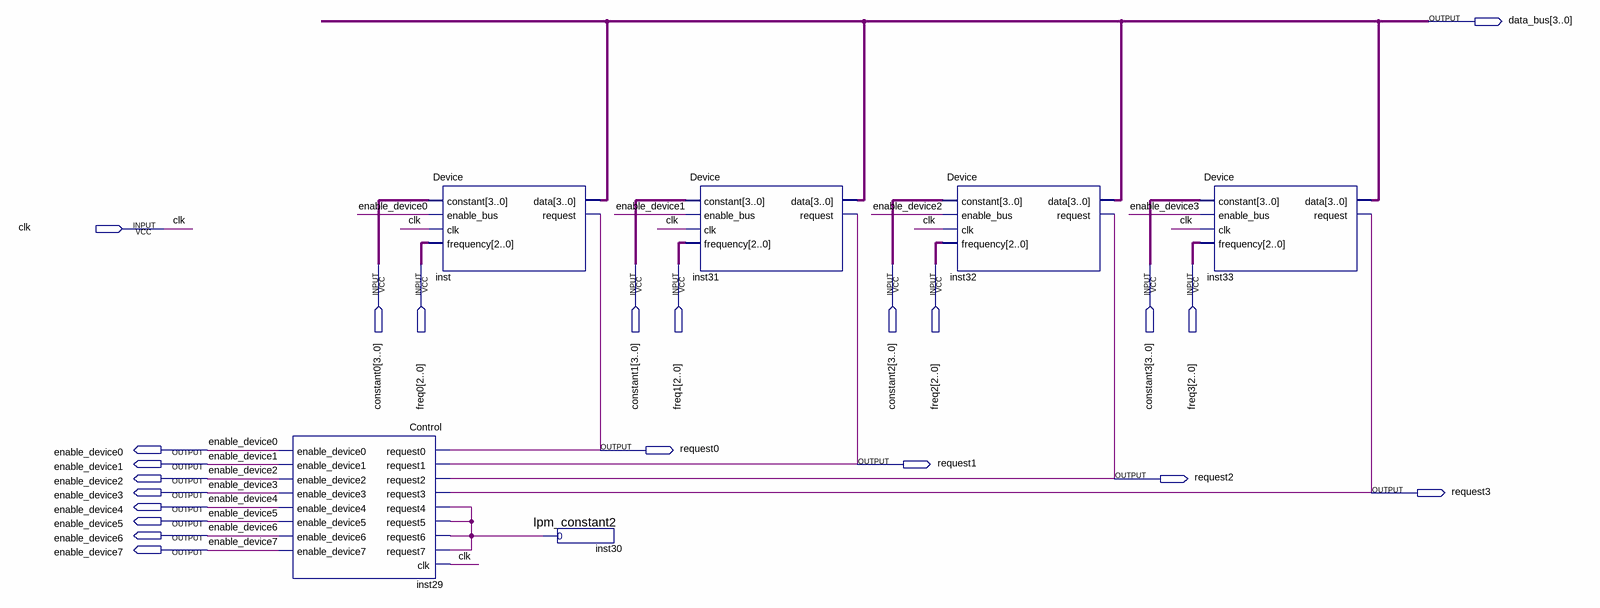
[diagram p0: schematic sheet]
// Quartus schematic LAB_5.bdf as structural Verilog: 6 symbols, 22 pins
module LAB_5 (
  input  clk,
  input  [3:0] constant0,
  input  [2:0] freq0,
  input  [3:0] constant1,
  input  [2:0] freq1,
  input  [3:0] constant2,
  input  [2:0] freq2,
  input  [3:0] constant3,
  input  [2:0] freq3,
  output [3:0] data_bus,
  output enable_device0,
  output request0,
  output enable_device1,
  output request1,
  output enable_device2,
  output request2,
  output enable_device3,
  output request3,
  output enable_device4,
  output enable_device5,
  output enable_device6,
  output enable_device7
);

  wire inst30_result;

  Control inst29 (
    .request0(request0), .request1(request1), .request2(request2), .request3(request3),
    .request4(inst30_result), .request5(inst30_result), .request6(inst30_result), .request7(inst30_result),
    .clk(clk), .enable_device0(enable_device0), .enable_device1(enable_device1),
    .enable_device2(enable_device2), .enable_device3(enable_device3), .enable_device4(enable_device4),
    .enable_device5(enable_device5), .enable_device6(enable_device6), .enable_device7(enable_device7));
  Device inst (
    .constant(constant0), .enable_bus(enable_device0), .clk(clk), .frequency(freq0), .data(data_bus),
    .request(request0));
  lpm_constant2 inst30 (.result(inst30_result));
  Device inst31 (
    .constant(constant1), .enable_bus(enable_device1), .clk(clk), .frequency(freq1), .data(data_bus),
    .request(request1));
  Device inst32 (
    .constant(constant2), .enable_bus(enable_device2), .clk(clk), .frequency(freq2), .data(data_bus),
    .request(request2));
  Device inst33 (
    .constant(constant3), .enable_bus(enable_device3), .clk(clk), .frequency(freq3), .data(data_bus),
    .request(request3));
endmodule
